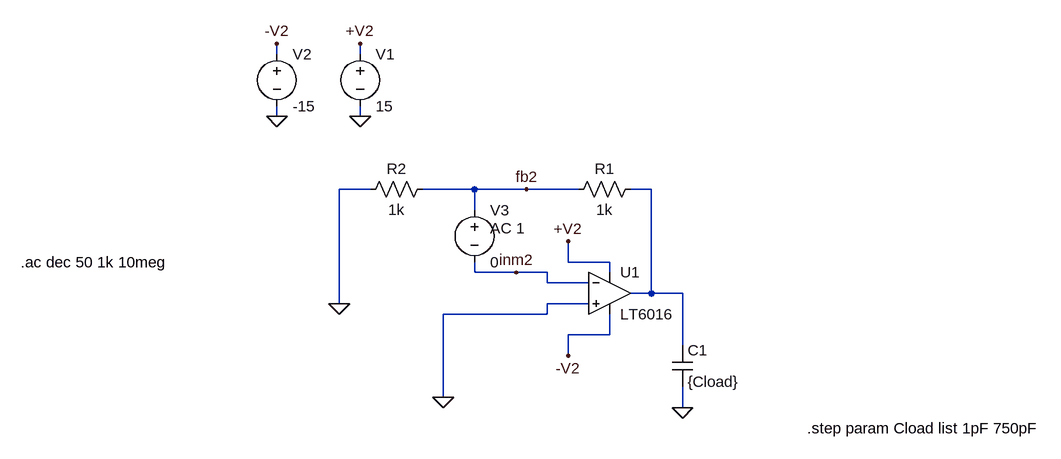
[diagram p0: schematic Draft2.asc]
Draft2.asc, the LTspice schematic file:
Version 4
SHEET 1 1028 680
WIRE -160 -48 -160 -64
WIRE -32 -48 -32 -64
WIRE -160 48 -160 32
WIRE -32 48 -32 32
WIRE -16 160 -64 160
WIRE 144 160 64 160
WIRE 224 160 144 160
WIRE 304 160 224 160
WIRE 416 160 384 160
WIRE 144 192 144 160
WIRE 288 272 288 240
WIRE 352 272 288 272
WIRE 144 288 144 272
WIRE 208 288 144 288
WIRE 256 288 208 288
WIRE 352 288 352 272
WIRE 256 304 256 288
WIRE 320 304 256 304
WIRE 416 320 416 160
WIRE 416 320 384 320
WIRE 464 320 416 320
WIRE -64 336 -64 160
WIRE 320 336 256 336
WIRE 256 352 256 336
WIRE 256 352 96 352
WIRE 352 384 352 352
WIRE 352 384 288 384
WIRE 464 400 464 320
WIRE 288 416 288 384
WIRE 96 480 96 352
WIRE 464 496 464 464
FLAG -32 48 0
FLAG 288 240 +V2
FLAG -32 -64 +V2
FLAG 288 416 -V2
FLAG -160 48 0
FLAG -160 -64 -V2
FLAG 96 480 0
FLAG 464 496 0
FLAG 224 160 fb2
FLAG 208 288 inm2
FLAG -64 336 0
SYMBOL voltage -32 -64 R0
WINDOW 123 0 0 Left 2
WINDOW 39 0 0 Left 2
SYMATTR InstName V1
SYMATTR Value 15
SYMBOL voltage -160 -64 R0
WINDOW 123 0 0 Left 2
WINDOW 39 0 0 Left 2
SYMATTR InstName V2
SYMATTR Value -15
SYMBOL res 400 144 R90
WINDOW 0 0 56 VBottom 2
WINDOW 3 32 56 VTop 2
SYMATTR InstName R1
SYMATTR Value 1k
SYMBOL cap 448 400 R0
SYMATTR InstName C1
SYMATTR Value {Cload}
SYMBOL voltage 144 176 R0
WINDOW 123 24 44 Left 2
WINDOW 39 0 0 Left 2
SYMATTR InstName V3
SYMATTR Value 0
SYMATTR Value2 AC 1
SYMBOL res 80 144 R90
WINDOW 0 0 56 VBottom 2
WINDOW 3 32 56 VTop 2
SYMATTR InstName R2
SYMATTR Value 1k
SYMBOL Opamps\\LT6016 352 320 R0
SYMATTR InstName U1
TEXT -554 272 Left 2 !.ac dec 50 1k 10meg
TEXT 656 528 Left 2 !.step param Cload list 1pF 750pF

The netlist it stands for:
* Draft2.asc
V1 +V2 0 15
V2 -V2 0 -15
R1 N001 fb2 1k
C1 N001 0 {Cload}
V3 fb2 inm2 0 AC 1
R2 fb2 0 1k
* U1: LT6016 (symbol Opamps\LT6016 not available, pins judged from their places): In+=0 In-=inm2 V+=+V2 V-=-V2 OUT=N001
.ac dec 50 1k 10meg
.step param Cload list 1pF 750pF
.backanno
.end